# Altium project BTL_SECURITY LOCK.PrjPcb
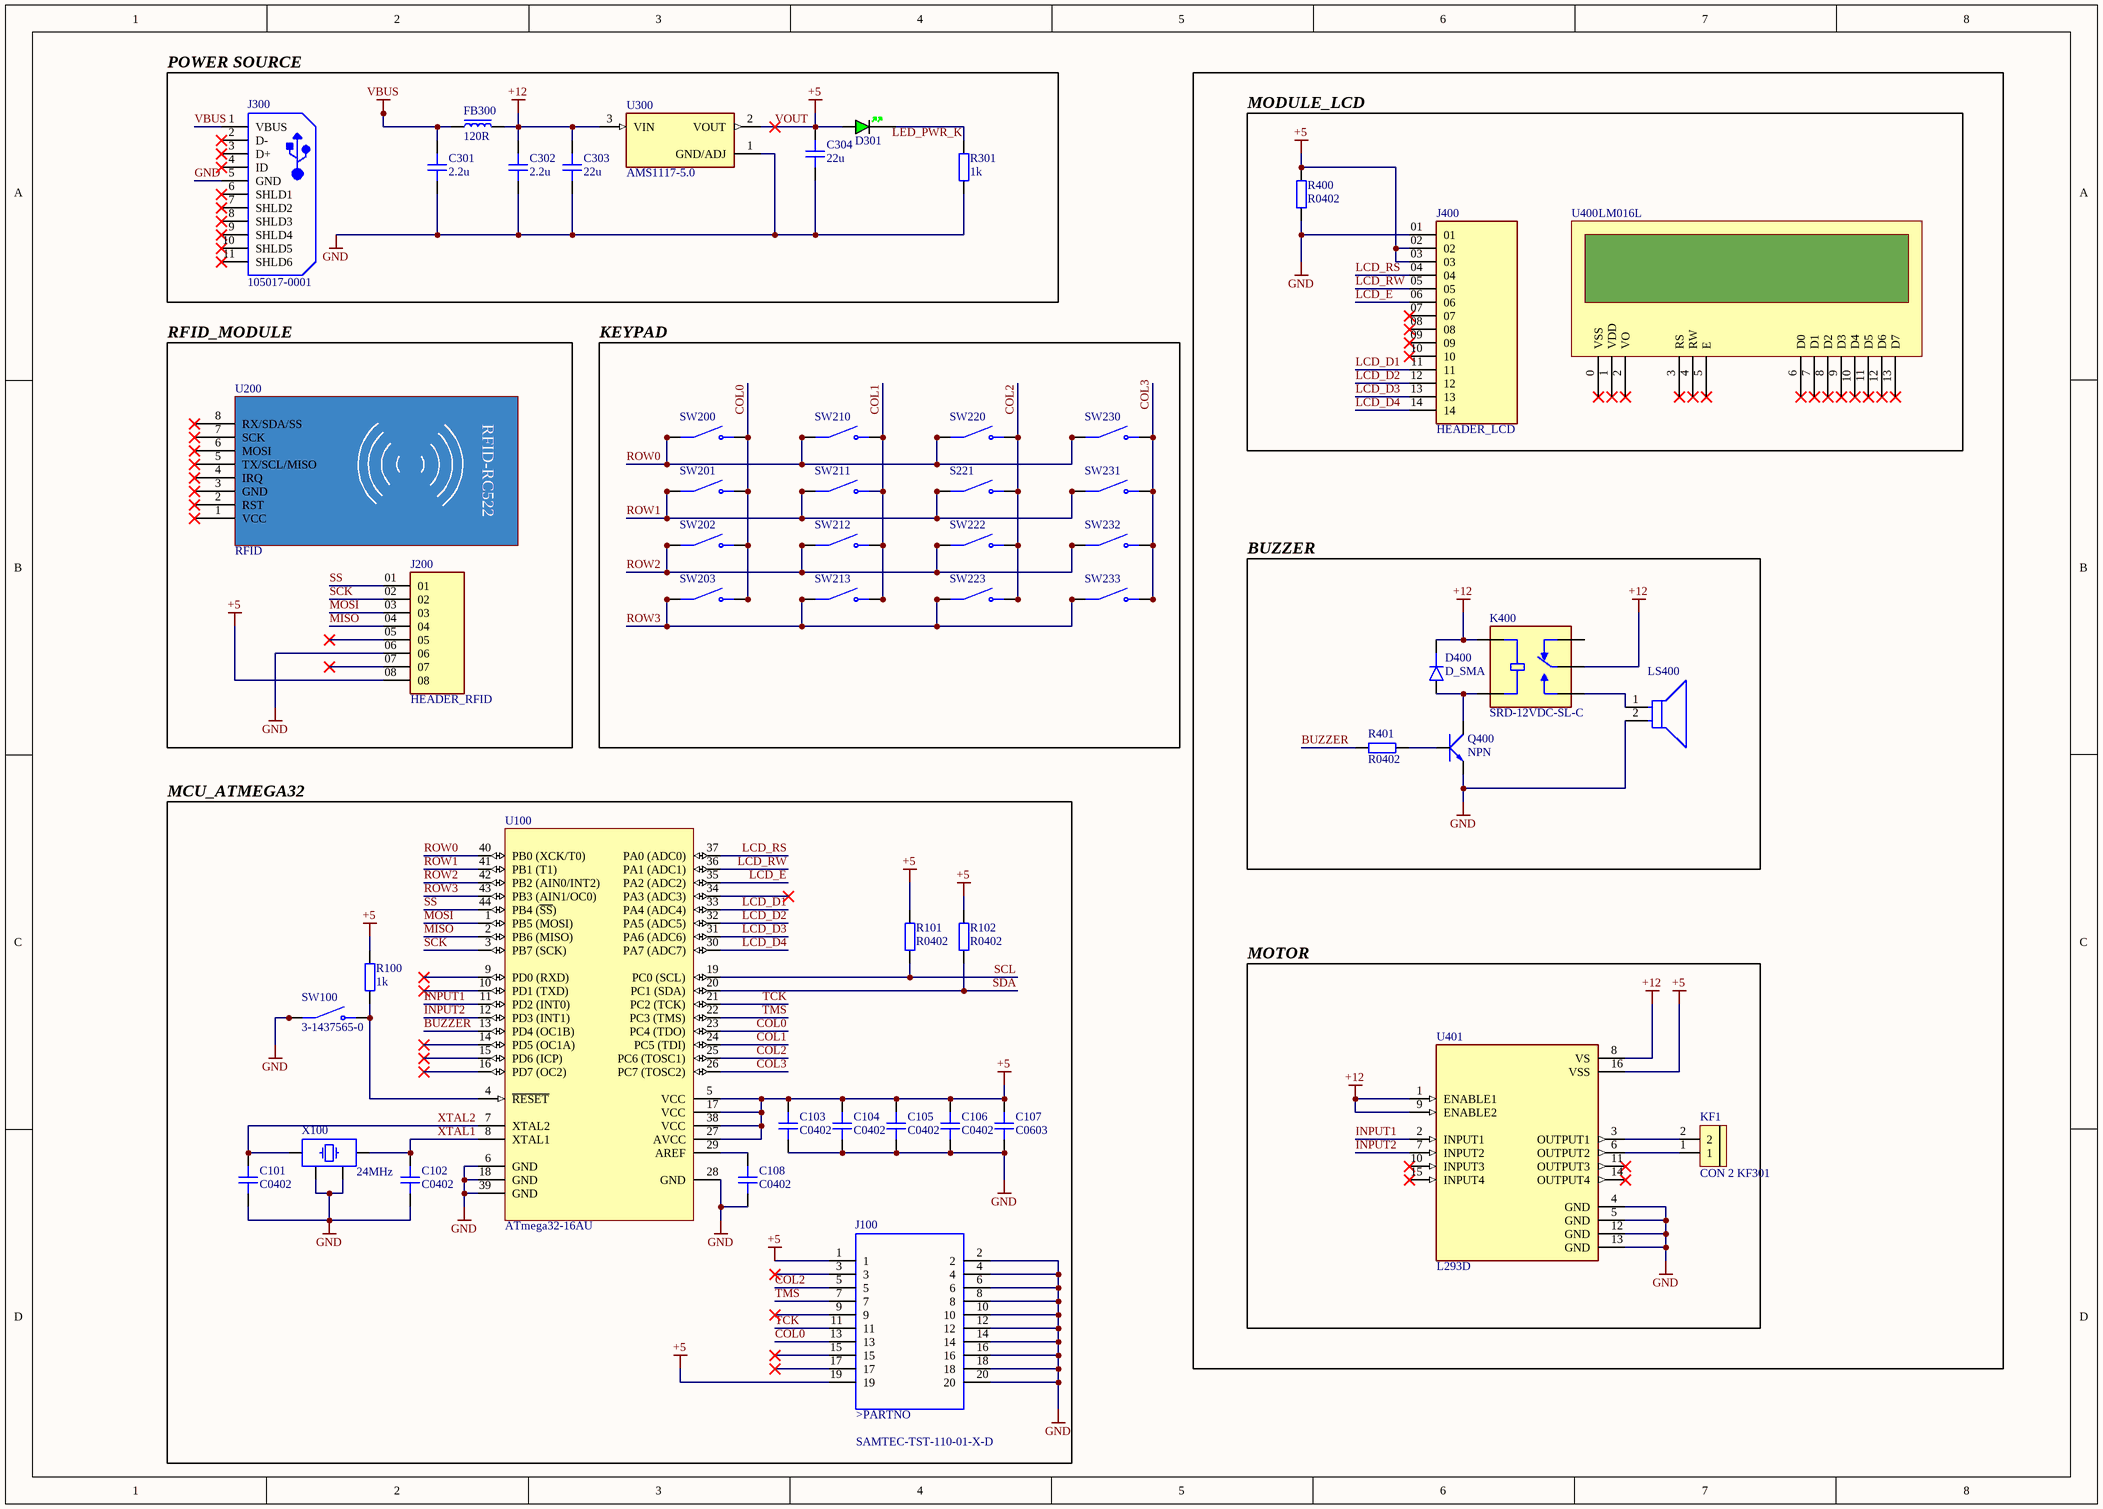
[diagram p0: SCHEMATIC.SchDoc]
1 sheet, 52 parts. Net scope: global (net labels, ports and power ports of the same name join across sheets).
Board file: PCB.PcbDoc

## Sheet SCHEMATIC.SchDoc
size A3; SheetNumber: 1; SheetTotal: 1

### Parts
C101  C0402  [CAP_0402]
C102  C0402  [CAP_0402]
C103  C0402  [CAP_0402]
C104  C0402  [CAP_0402]
C105  C0402  [CAP_0402]
C106  C0402  [CAP_0402]
C107  C0603  [CAP_0603]
C108  C0402  [CAP_0402]
C301  2.2u  [CAP_0603]
C302  2.2u  [CAP_0603]
C303  22u  [CAP_0805]
C304  22u  [CAP_0805]
D301  GREEN  [LED_0402_GREEN]  (value not drawn)
D400  D_SMA  [DO-214AC-2 (SMA)]
FB300  120R  [FB_0603]
J100  (no value)  [SAMTEC-TST-110-01-X-D]
J200  HEADER_RFID  [SAMTEC_TSW-108-X-X-S]
J300  105017-0001  [USB-MICRO-B_V]
J400  HEADER_LCD  [SAMTEC_TSW-114-07-L-S]
K400  SRD-12VDC-SL-C  [RELAY_SRD-12VDC-SL-C]
KF1  CON 2 KF301  [Con 2 KF301 5.08]
LS400  PKB24SPCH3601-B0  [FP-PKB24SPCH3601-B0-MFG]  (value not drawn)
Q400  NPN  [TO92]
R100  1k  [RES_0402]
R101  R0402  [RES_0402]
R102  R0402  [RES_0402]
R301  1k  [RES_0402]
R400  R0402  [RES_0402]
R401  R0402  [RES_0402]
S221  3-1437565-0  [SW_3-1437565-0]  (value not drawn)
SW100  3-1437565-0  [SW_3-1437565-0]
SW200  3-1437565-0  [SW_3-1437565-0]  (value not drawn)
SW201  3-1437565-0  [SW_3-1437565-0]  (value not drawn)
SW202  3-1437565-0  [SW_3-1437565-0]  (value not drawn)
SW203  3-1437565-0  [SW_3-1437565-0]  (value not drawn)
SW210  3-1437565-0  [SW_3-1437565-0]  (value not drawn)
SW211  3-1437565-0  [SW_3-1437565-0]  (value not drawn)
SW212  3-1437565-0  [SW_3-1437565-0]  (value not drawn)
SW213  3-1437565-0  [SW_3-1437565-0]  (value not drawn)
SW220  3-1437565-0  [SW_3-1437565-0]  (value not drawn)
SW222  3-1437565-0  [SW_3-1437565-0]  (value not drawn)
SW223  3-1437565-0  [SW_3-1437565-0]  (value not drawn)
SW230  3-1437565-0  [SW_3-1437565-0]  (value not drawn)
SW231  3-1437565-0  [SW_3-1437565-0]  (value not drawn)
SW232  3-1437565-0  [SW_3-1437565-0]  (value not drawn)
SW233  3-1437565-0  [SW_3-1437565-0]  (value not drawn)
U100  ATmega32-16AU  [44A_N]
U200  RFID
U300  AMS1117-5.0  [SOT229P700X180-4N]
U400  LM016L
U401  L293D  [DIP880W50P254L2000H510Q16]
X100  24MHz  [XTAL_3225]

### Blocks framed on the sheet
POWER SOURCE: C301-C304 D301 FB300 J300 R301 U300
MODULE_LCD: J400 R400 U400
RFID_MODULE: J200 U200
KEYPAD: S221 SW200-SW203 SW210-SW213 SW220 SW222 SW223 SW230-SW233
BUZZER: D400 K400 LS400 Q400 R401
MCU_ATMEGA32: C101-C108 J100 R100-R102 SW100 U100 X100
MOTOR: KF1 U401

### Nets
+12: C302.2 C303.2 D400.K FB300.2 K400.COIL1 K400.COM U300.3(VIN) U401.1(ENABLE1) U401.8(VS) U401.9(ENABLE2)
GND: C101.1 C102.1 C103.1 C104.1 C105.1 C106.1 C107.1 C108.1 C301.1 C302.1 C303.1 C304.1 J100.2 J100.4 J100.6 J100.8 J100.10 J100.12 J100.14 J100.16 J100.18 J100.20 J200.06 J300.5(GND) J400.01 LS400.2(A) Q400.1(E) R301.1 R400.1 SW100.1(COM) SW100.2(COM) U100.6(GND) U100.18(GND) U100.28(GND) U100.39(GND) U300.1(GND/ADJ) U401.4(GND) U401.5(GND) U401.12(GND) U401.13(GND) X100.2 X100.4
VBUS: C301.2 FB300.1 J300.1(VBUS)
VOUT: C103.2 C104.2 C105.2 C106.2 C107.2 C304.2 D301.A J100.1 J100.19 J200.08 J400.02 J400.03 R100.2 R101.2 R102.2 R400.2 U100.5(VCC) U100.17(VCC) U100.27(AVCC) U100.38(VCC) U300.2(VOUT) U401.16(VSS)  [also labelled +5]
BUZZER: R401.1 U100.13(PD4_(OC1B))
COL0: J100.13 SW200.3(NO) SW200.4(NO) SW201.3(NO) SW201.4(NO) SW202.3(NO) SW202.4(NO) SW203.3(NO) SW203.4(NO) U100.23(PC4_(TDO))
COL1: SW210.3(NO) SW210.4(NO) SW211.3(NO) SW211.4(NO) SW212.3(NO) SW212.4(NO) SW213.3(NO) SW213.4(NO) U100.24(PC5_(TDI))
COL2: J100.5 S221.3(NO) S221.4(NO) SW220.3(NO) SW220.4(NO) SW222.3(NO) SW222.4(NO) SW223.3(NO) SW223.4(NO) U100.25(PC6_(TOSC1))
COL3: SW230.3(NO) SW230.4(NO) SW231.3(NO) SW231.4(NO) SW232.3(NO) SW232.4(NO) SW233.3(NO) SW233.4(NO) U100.26(PC7_(TOSC2))
INPUT1: U100.11(PD2_(INT0)) U401.2(INPUT1)
INPUT2: U100.12(PD3_(INT1)) U401.7(INPUT2)
LCD_D1: J400.11 U100.33(PA4_(ADC4))
LCD_D2: J400.12 U100.32(PA5_(ADC5))
LCD_D3: J400.13 U100.31(PA6_(ADC6))
LCD_D4: J400.14 U100.30(PA7_(ADC7))
LCD_E: J400.06 U100.35(PA2_(ADC2))
LCD_RS: J400.04 U100.37(PA0_(ADC0))
LCD_RW: J400.05 U100.36(PA1_(ADC1))
LED_PWR_K: D301.K R301.2
MISO: J200.04 U100.2(PB6_(MISO))
MOSI: J200.03 U100.1(PB5_(MOSI))
ROW0: SW200.1(COM) SW200.2(COM) SW210.1(COM) SW210.2(COM) SW220.1(COM) SW220.2(COM) SW230.1(COM) SW230.2(COM) U100.40(PB0_(XCK/T0))
ROW1: S221.1(COM) S221.2(COM) SW201.1(COM) SW201.2(COM) SW211.1(COM) SW211.2(COM) SW231.1(COM) SW231.2(COM) U100.41(PB1_(T1))
ROW2: SW202.1(COM) SW202.2(COM) SW212.1(COM) SW212.2(COM) SW222.1(COM) SW222.2(COM) SW232.1(COM) SW232.2(COM) U100.42(PB2_(AIN0/INT2))
ROW3: SW203.1(COM) SW203.2(COM) SW213.1(COM) SW213.2(COM) SW223.1(COM) SW223.2(COM) SW233.1(COM) SW233.2(COM) U100.43(PB3_(AIN1/OC0))
SCK: J200.02 U100.3(PB7_(SCK))
SCL: R101.1 U100.19(PC0_(SCL))
SDA: R102.1 U100.20(PC1_(SDA))
SS: J200.01 U100.44(PB4_(~{SS}))
TCK: J100.11 U100.21(PC2_(TCK))
TMS: J100.7 U100.22(PC3_(TMS))
XTAL1: C102.2 U100.8(XTAL1) X100.3
XTAL2: C101.2 U100.7(XTAL2) X100.1
NetC108_2: C108.2 U100.29(AREF)
NetD400_A: D400.A K400.COIL2 Q400.3(C)
NetK400_NO: K400.NO LS400.1(C)
NetKF1_1: KF1.1 U401.6(OUTPUT2)
NetKF1_2: KF1.2 U401.3(OUTPUT1)
NetQ400_2: Q400.2(B) R401.2
NetR100_1: R100.1 SW100.3(NO) SW100.4(NO) U100.4(~{RESET})

Not connected (* = marked no-connect by the designer): J100 3* 9* 15* 17*; J200 05* 07*; J300 2(D-)* 3(D+)* 4(ID)* 6(SHLD1)* 7(SHLD2)* 8(SHLD3)* 9(SHLD4)* 10(SHLD5)* 11(SHLD6)*; J400 07* 08* 09* 10*; K400 NC; U100 9(PD0_(RXD))* 10(PD1_(TXD))* 14(PD5_(OC1A))* 15(PD6_(ICP))* 16(PD7_(OC2))* 34(PA3_(ADC3))*; U200 1(VCC)* 2(RST)* 3(GND)* 4(IRQ)* 5(TX/SCL/MISO)* 6(MOSI)* 7(SCK)* 8(RX/SDA/SS)*; U400 0(VSS)* 1(VDD)* 2(VO)* 3(RS)* 4(RW)* 5(E)* 6(D0)* 7(D1)* 8(D2)* 9(D3)* 10(D4)* 11(D5)* 12(D6)* 13(D7)*; U401 10(INPUT3)* 11(OUTPUT3)* 14(OUTPUT4)* 15(INPUT4)*

### Notes on the sheet
- (in symbol Component_1) RFID-RC522
- (in symbol SAMTEC-TST-110-01-X-D) >PARTNO

### Library data of the parts
C101-C106 C108 = CAP_0402: Capacitor SMD 0402; Manufacturer: *; Manufacturer Part Number: *; Distributor Link: *; LCSC: *; Rating: *; Dielectric: *
C107 C301 C302 = CAP_0603: Capacitor SMD 0603; Manufacturer: *; Manufacturer Part Number: *; Distributor Link: *; LCSC: *; Rating: *; Dielectric: *
C303 C304 = CAP_0805: Capacitor SMD 0805; Manufacturer: *; Manufacturer Part Number: *; Distributor Link: *; LCSC: *; Rating: *; Dielectric: *
D301 = LED_0402_GREEN: LED 0402 GREEN SMD
D400 = D_SMA: Diode SMD SMA (DO-214AA)
FB300 = FB_0603: Ferrite Bead SMD 0603; Manufacturer: *; Manufacturer Part Number: *; Distributor Link: *; LCSC: *
J100 = SAMTEC-TST-110-01-X-D: MF: Samtec; Availability: Unavailable; Value: *; Package: None; Price: None; MP: SAMTEC-TST-110-01-X-D
J200 = TSW-108-X-X-S: Connector Header Through Hole 8 position 0.100 (2.54mm); MF: Samtec; MP: TSW-108-23-L-S; SnapEDA_Link: https://www.snapeda.com/parts/TSW-108-23-L-S/Samtec/view-part/?ref=snap; Package: None; Value: *; Check_prices: https://www.snapeda.com/parts/TSW-108-23-L-S/Samtec/view-part/?ref=eda
J300 = CMP-2000-05827-1: Micro-USB B Receptacle, Right Angle, Bottom Mount, Surface Mount, with Solder Tabs, -30 to 85 degC, 5-Pin USB, RoHS, Tape and Reel; Manufacturer: Molex; Featured Product: Micro-USBConnectorsUSBConnectors; Other Names: WM1399DKR; Package Version: Rev. F, 12/2012; Number of Contacts: 5; Connector Type: USB-microB; Catalog Drawings: 1050170001; 3D Model: 105017-0001.stp; Mating Products: WM17145-ND-CABLEMICROUSBBTOSTDA1.0MWM17147-ND-CABLEMICROUSBBTOSTDA2.0MWM17146-ND-CABLEMICROUSBBTOSTDA1.5M; PCN Assembly/Origin: ResinSupplier21/Oct/2015; Voltage - Max: 30V; Online Catalog: Molex-MicroUSB; Manufacturer URL: http://www.molex.com/; Package Description: 5-Leads USB, Micro B, Body 7.5 x 5 mm, Pitch 0.65 mm; Datasheet URL: http://www.molex.com/elqNow/elqRedir.htm?ref=http://www.molex.com/webdocs/datasheets/pdf/en-us/1050170001_IO_CONNECTORS.pdf; Ingress Protection: -; Datasheet Version: 03/2016; Mounting Type: BoardCutout,SurfaceMount,RightAngle; Circuits: 5; Standard Package: 1; Package Reference: MICRO-B; Package URL: http://www.molex.com/pdm_docs/sd/1050170001_sd.pdf; Category: Connectors,Interconnects; Series: -; RoHS Information: 1050170001CertofCompliance; Features: Shielded,SolderRetention; Family: USB,DVI,HDMIConnectors; Specifications: -; Gender: Receptacle; Packaging: Digi-Reel®; Mounting Technology: SurfaceMount
J400 = TSW-114-07-L-S: Connector Header Through Hole 14 position 0.100 (2.54mm); MF: Samtec Inc.; SnapEDA_Link: https://www.snapeda.com/parts/TSW-114-07-L-S/Samtec+Inc./view-part/?ref=snap; Package: None; Value: *; MP: TSW-114-07-L-S; Check_prices: https://www.snapeda.com/parts/TSW-114-07-L-S/Samtec+Inc./view-part/?ref=eda
K400 = SRD-12VDC-SL-C: General Purpose Non Latching 12VDC SPDT Through Hole Relays RoHS; Price: None; Package: None; Availability: Unavailable; MP: SRD-12VDC-SL-C; Value: *
KF1 = CON 2 KF301: Cắm; Ma_Hang: MH000987; Ten_Linh_Kien: CON 2 KF301-2P 5.08MM Xanh Dương; Chung_Loai: Cắm; Ghi_Chu: *; Kieu_Chan: *; Don_Vi: Con
LS400 = CMP-06203-000001-2: AUDIO PIEZO TRANSDUCER 3-15V TH; Self Resonant Frequency: 3.6kHz; Voltage Rating (DC): 15V; Min Supply Voltage: 3V; Operating Supply Current: 16mA; Voltage Rating: 12V; Max Frequency: 4.1kHz; Washable: No; REACH SVHC: No SVHC; Packaging: Bulk; Frequency: 3.6kHz; Max Operating Temperature: 70°C; Max Supply Voltage: 15V; Max Supply Voltage (DC): 15V; Diameter: 24.3mm; Lead Free: Lead Free; Radiation Hardening: No; Nominal Supply Current: 16mA; Height: 9.7mm; Mount: Flush; Nominal Supply Voltage (DC): 12V; Min Operating Temperature: -20°C; Termination: PC Pins; Length: 24.3mm; Package Quantity: 650; Min Supply Voltage (DC): 3V; Max Supply Current: 16mA
Q400 = Trans 2N3904: NPN transistor EBC; Value: C9014
R100-R102 R301 R400 R401 = RES_0402: Resistor SMD 0402; Manufacturer: *; Manufacturer Part Number: *; Distributor Link: *; LCSC: *
S221 SW100 SW200-SW203 SW210-SW213 SW220 SW222 SW223 SW230-SW233 = 3-1437565-0: Switch Tactile OFF (ON) SPST Round Button Gull Wing 0.05A 24VDC 1VA 9.18N SMD T/R; MF: TE Connectivity; MP: 3-1437565-0; Package: SMD-6 Omron Electronics; Purchase-URL: https://pricing.snapeda.com/search/part/3-1437565-0/?ref=eda; Price: None; Value: *; SnapEDA_Link: https://www.snapeda.com/parts/3-1437565-0/TE%20Connectivity/view-part/294084/?ref=snap; Availability: Good
U100 = CMP-0095-00554-1: 8-bit AVR Microcontroller, 4.5-5.5V, 16MHz, 32KB Flash, 1024 Bytes EEPROM, 2KB SRAM, 44-pin TQFP, Industrial Grade (-40°C to 85°C); ComponentLink1URL: http://www.atmel.com/; Code_JEDEC: MS-026-ACB; PackageDescription: 44-Pin Plastic Thin Profile Quad Flat Pack, 10 x 10 x 1.0 mm Body, 0.8 mm Pitch (TQFP); ComponentLink2Description: ATmega32(L) Datasheet; ComponentLink3URL: http://atmel.com/dyn/resources/prod_documents/2503S.pdf; PackageVersion: revC, Oct-2010; ComponentLink1Description: Manufacturer URL; ComponentLink3Description: ATmega32(L) Summary; ComponentLink2URL: http://atmel.com/dyn/resources/prod_documents/doc2503.pdf; PackageReference: 44A; DatasheetVersion: revQ, Feb-2011
U200 = Component_1
U300 = AMS1117-5.0: 1A LOW DROPOUT VOLTAGE REGULATOR; MF: ams; MP: AMS1117-5.0; Package: SOT-223 Seeed Technology; SnapEDA_Link: https://www.snapeda.com/parts/AMS1117-5.0/ams/view-part/?ref=snap; Check_prices: https://www.snapeda.com/parts/AMS1117-5.0/ams/view-part/?ref=eda; Availability: Not in stock; Value: *; Price: None
U401 = L293D: Bipolar Motor Driver - Parallel 16-PowerDIP; MF: STMicroelectronics; MP: L293D; Package: DIP-16 STMicroelectronics; SnapEDA_Link: https://www.snapeda.com/parts/L293D/STMicroelectronics/view-part/?ref=snap; Purchase-URL: https://pricing.snapeda.com/search/part/L293D/?ref=eda; Check_prices: https://www.snapeda.com/parts/L293D/STMicroelectronics/view-part/?ref=eda; Availability: In Stock; Value: *; Price: None
X100 = TSX-3225_24.0000MF15X-AC: Crystal SMD 24MHz 10PPM 7pF 3225; Manufacturer: Epson; Manufacturer Part Number: TSX-3225 24.0000MF15X-AC